# Altium schematic sheet DAC.SchDoc
size A4; SheetNumber: 6; SheetTotal: 7
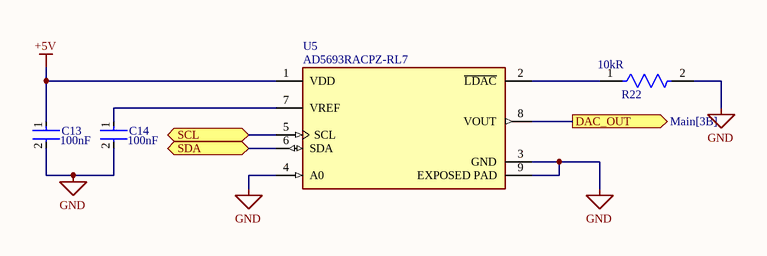
[diagram p0: DAC.SchDoc]

## Parts
C13  Capacitance: 100nF  [FP-C2012-125-0_45-MFG]  (hidden comment: C2012X7T2E104K125AE)
C14  Capacitance: 100nF  [FP-C2012-125-0_45-MFG]  (hidden comment: C2012X7T2E104K125AE)
R22  Resistance: 10kR  [FP-ERJP06-MFG]  (hidden comment: ERJ-P06F1002V)
U5  AD5693RACPZ-RL7  [FP-CP-8-10-IPC_C]

## Ports
DAC_OUT (out, see Main[3B]), SCL (bidir, see Main[2B], MCU[3B], Sense Amplifier[3B]), SDA (bidir, see Main[2B], MCU[3B], Sense Amplifier[3B])

## Nets
+5V: C13.1 U5.1(VDD)
GND: C13.2 C14.2 R22.2 U5.3(GND) U5.4(A0) U5.9(EXPOSED_PAD)
DAC_OUT: U5.8(VOUT) ; port DAC_OUT
SCL: U5.5(SCL) ; port SCL
SDA: U5.6(SDA) ; port SDA
NetC14_1: C14.1 U5.7(VREF)
NetR22_1: R22.1 U5.2(~{LDAC})

## Library data of the parts
C13 C14 = CMP-08246-004341-1: CAP CER 0.1UF 250V X7T 0805; Tolerance: 10%; Case Code (Metric): 2012; Package Quantity: 1; Max Operating Temperature: 125°C; Thickness: 0.049inch; Case Code (Imperial): 0805; Features: Soft Termination; Length: 2mm; Weight: 0.000194oz; Min Operating Temperature: -55°C; Case/Package: 0805; Mount: Surface Mount; REACH SVHC: No SVHC; Dielectric: X7T; Voltage Rating: 250V; Width: 0.05inch; Series: C; Packaging: Tape and Reel; Depth: 1.25mm; Resistor Type: Ceramic; Voltage Rating (DC): 250V; Height: 1.25mm; Termination: SMD/SMT; RoHS Compliant: Yes
R22 = CMP-05422-000126-1: RES SMD 10K OHM 1% 1/2W 0805; Temperature Coefficient: 100ppm/°C; Voltage Rating (DC): 150V; Max Power Dissipation: 500mW; Termination: SMD/SMT; Tolerance: 1%; Width: 1.2mm; Case/Package: 0805; Number of Terminations: 2; Resistor Type: Thick Film; Radiation Hardening: No; Resistance Tolerance: 1%; Package Quantity: 5000; Max Operating Temperature: 155°C; RoHS Compliant: Yes; Mount: Surface Mount; Case Code (Imperial): 0805; Construction: Rectangular; Height: 0.6mm; Lead Free: Lead Free; Depth: 1.25mm; Packaging: Tape and Reel; REACH SVHC: No SVHC; Technology: THICK FILM; Features: Automotive AEC-Q200; Contact Plating: Tin; Voltage Rating: 150V; Military Standard: Not; Power Rating: 500mW; Case Code (Metric): 2012; Length: 2mm; Min Operating Temperature: -55°C; Series: ERJ
U5 = CMP-09082-000029-1: IC DAC 16BIT V-OUT 8LFCSP; Settling Time: 5us; Interface: I2C; Slew Rate: 0.7V/µs; Number of Bits: 16; Number of D/A Converters: 1; Min Output Voltage: 0uV; Integral Nonlinearity (INL): 8LSB; Signal to Noise Ratio (SNR): 90dB; Resolution: 16b; Min Supply Voltage: 2.7V; Max Input Voltage: 5.5V; Polarity: Unipolar; Differential Output: No; Output Type: Voltage; RoHS Compliant: Yes; Min Operating Temperature: -40°C; Max Operating Temperature: 105°C; Number of Pins: 8; Mount: Surface Mount; Lead Free: Contains Lead; Packaging: Tape and Reel; Number of DAC Channels: 1; Max Output Voltage: 5.5V; Max Supply Voltage: 5.5V